# EAGLE design Isolator_12 (EAGLE 9.6.2)
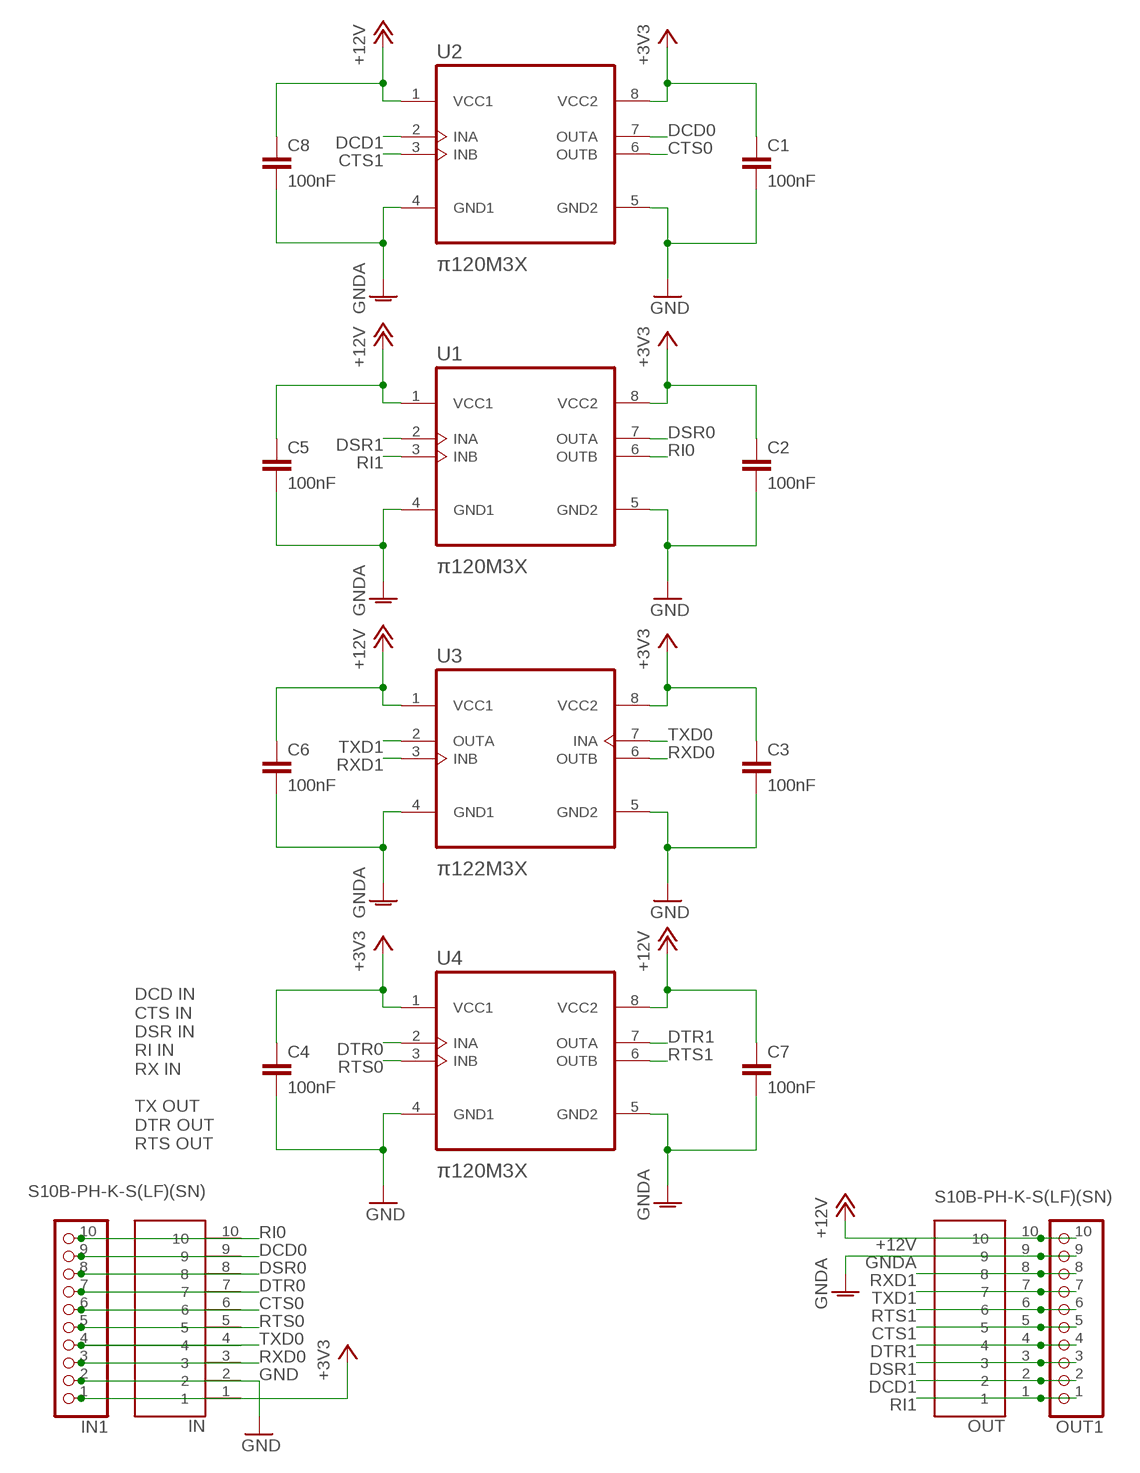
[diagram p0: schematic, sheet 1]

## Parts
C1  100nF  C-EUC0805  [C0805]
C2  100nF  C-EUC0805  [C0805]
C3  100nF  C-EUC0805  [C0805]
C4  100nF  C-EUC0805  [C0805]
C5  100nF  C-EUC0805  [C0805]
C6  100nF  C-EUC0805  [C0805]
C7  100nF  C-EUC0805  [C0805]
C8  100nF  C-EUC0805  [C0805]
IN  S10B-PH-K-S(LF)(SN)  [JST_S10B-PH-K-S(LF)(SN)]
IN1  PINHD-1X10  [1X10]
OUT  S10B-PH-K-S(LF)(SN)  [JST_S10B-PH-K-S(LF)(SN)]
OUT1  PINHD-1X10  [1X10]
U1  π120M3X  π120X3X  [SOIC-8]
U2  π120M3X  π120X3X  [SOIC-8]
U3  π122M3X  π122X3X  [SOIC-8]
U4  π120M3X  π120X3X  [SOIC-8]

## Nets
+3V3: C1.1 C2.1 C3.1 C4.1 IN1.1 IN.1 U1.8(VCC2) U2.8(VCC2) U3.8(VCC2) U4.1(VCC1)
+12V: C5.1 C6.1 C7.1 C8.1 OUT1.10 OUT.10 U1.1(VCC1) U2.1(VCC1) U3.1(VCC1) U4.8(VCC2)
CTS0: IN1.6 IN.6 U2.6(OUTB)
CTS1: OUT1.5 OUT.5 U2.3(INB)
DCD0: IN1.9 IN.9 U2.7(OUTA)
DCD1: OUT1.2 OUT.2 U2.2(INA)
DSR0: IN1.8 IN.8 U1.7(OUTA)
DSR1: OUT1.3 OUT.3 U1.2(INA)
DTR0: IN1.7 IN.7 U4.2(INA)
DTR1: OUT1.4 OUT.4 U4.7(OUTA)
GND: C1.2 C2.2 C3.2 C4.2 IN1.2 IN.2 U1.5(GND2) U2.5(GND2) U3.5(GND2) U4.4(GND1)
GNDA: C5.2 C6.2 C7.2 C8.2 OUT1.9 OUT.9 U1.4(GND1) U2.4(GND1) U3.4(GND1) U4.5(GND2)
RI0: IN1.10 IN.10 U1.6(OUTB)
RI1: OUT1.1 OUT.1 U1.3(INB)
RTS0: IN1.5 IN.5 U4.3(INB)
RTS1: OUT1.6 OUT.6 U4.6(OUTB)
RXD0: IN1.3 IN.3 U3.6(OUTB)
RXD1: OUT1.8 OUT.8 U3.3(INB)
TXD0: IN1.4 IN.4 U3.7(INA)
TXD1: OUT1.7 OUT.7 U3.2(OUTA)

## Notes on the sheet
- DCD IN
  CTS IN
  DSR IN
  RI IN
  RX IN
  
  TX OUT
  DTR OUT
  RTS OUT

## Library data of the parts
C1-C8 = rcl:C-EU: CAPACITOR, European symbol; SPICEPREFIX: C
IN OUT = S10B-PH-K-S_LF__SN_:S10B-PH-K-S(LF)(SN): PH Series 6 Position 2 mm Pitch Through Hole Side Entry Shrouded Header Check availability <https://pricing.snapeda.com/parts/S6B-PH-K-S%28LF%29%28SN%29/JST%20Sales/view-part?ref=eda>; AVAILABILITY: In Stock; DESCRIPTION: Connector Header Through Hole, Right Angle 6 position 0.079 (2.00mm); MF: JST Sales; MP: S6B-PH-K-S(LF)(SN); PACKAGE: None; PRICE: None; PURCHASE-URL: https://pricing.snapeda.com/search/part/S6B-PH-K-S(LF)(SN)/?ref=eda
IN1 OUT1 = pinhead:PINHD-1X10: PIN HEADER
U1 U2 U4 = π12XX3X:π120X3X: Check availability <https://pricing.snapeda.com/parts/ISO7421D/Texas%20Instruments/view-part?ref=eda>; AVAILABILITY: In Stock; DESCRIPTION: Dual-channel, 1/1, 1-Mbps digital isolator; MF: Texas Instruments; MP: ISO7421D; PACKAGE: SOIC-8 Texas Instruments; PRICE: None; PURCHASE-URL: https://pricing.snapeda.com/search/part/ISO7421D/?ref=eda
U3 = π12XX3X:π122X3X: Check availability <https://pricing.snapeda.com/parts/ISO7421D/Texas%20Instruments/view-part?ref=eda>; AVAILABILITY: In Stock; DESCRIPTION: Dual-channel, 1/1, 1-Mbps digital isolator; MF: Texas Instruments; MP: ISO7421D; PACKAGE: SOIC-8 Texas Instruments; PRICE: None; PURCHASE-URL: https://pricing.snapeda.com/search/part/ISO7421D/?ref=eda

## Board
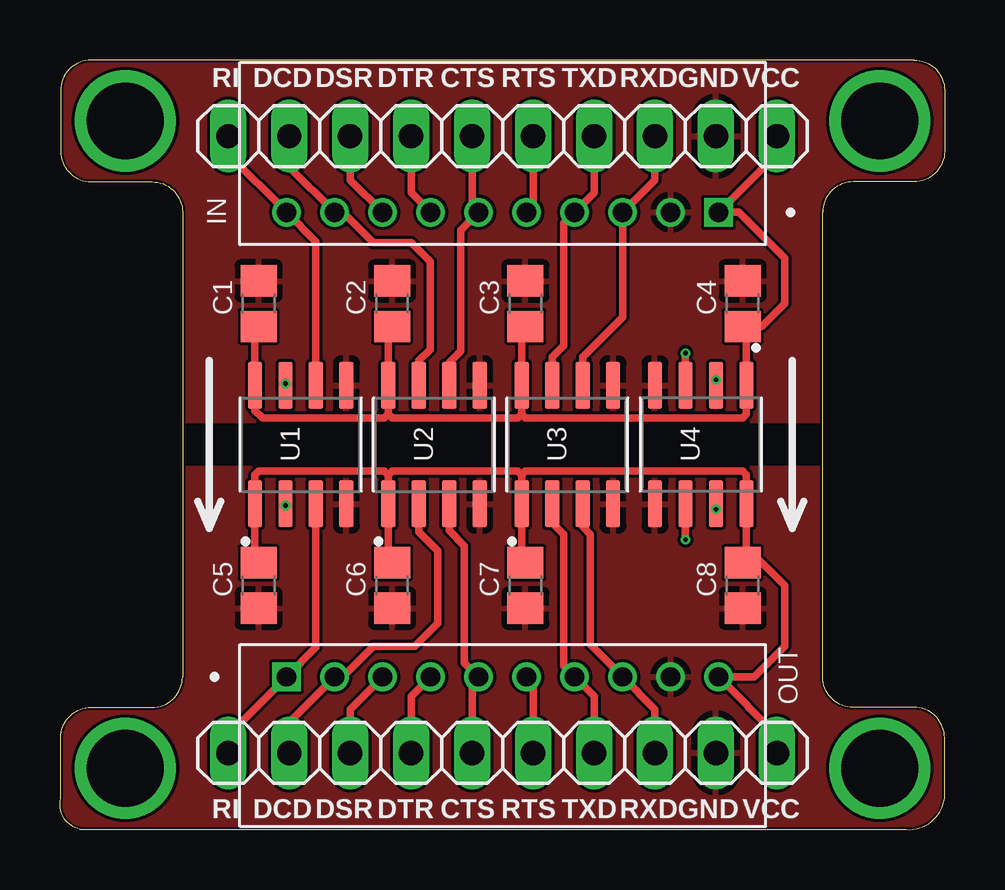
[diagram p1: board, top side]
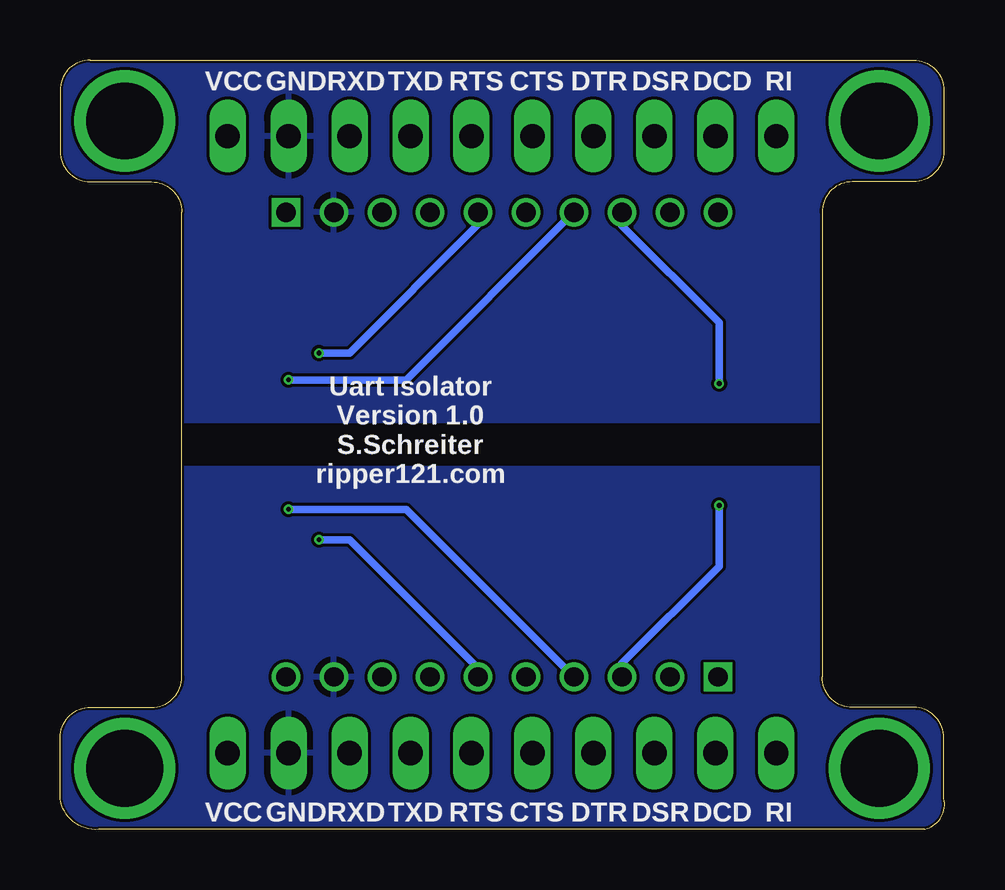
[diagram p2: board, bottom side, seen from below]

Size 36.86 x 32.09 mm. Coordinates in mm from the lower left corner, seen from the top.
Outline: 5.11,25.74 5.11,6.37 arc-90 3.84,5.1 1.3,5.1 arc90 0.03,3.83 0.03,1.29 arc90 0.82,0.02 35.11,0.02 arc90 36.86,1.29 36.86,3.83 arc90 35.59,5.1 33.05,5.1 arc-90 31.78,6.37 31.78,25.74 arc-90 33.05,27.01 35.59,27.01 arc90 36.86,28.28 36.86,30.82 arc90 35.59,32.09 1.3,32.09 arc90 0.03,30.82 0.03,28.28 arc90 1.3,27.01 3.84,27.01 arc-90 5.11,25.74
Copper layers (1*16): Top 0.035mm / dielectric 1.6mm / Bottom 0.035mm
Design rules "jlcpcb-2-layer *": minimum track width 12mil, minimum drill 0.2mm, track to track 5mil, track to pad 5mil, pad to pad 5mil, via to via 5mil, smd to smd 0mil, copper to edge 0.1mm, drill to drill 5mil, minimum pad ring 4mil, minimum via ring 4mil, stop-mask expansion 3mil, vias tented up to drill 100mil, thermal gap 10mil

### Footprints (pad centres in the part's own frame; a part is rotated, then mirrored left to right if it is on the bottom)
C0805 = smd 1.3 x 1.5: 1 -0.95,0; 2 0.95,0
JST_S10B-PH-K-S(LF)(SN) = drill 0.8 pad 1.2 square: 1 -9,0 | drill 0.8 pad 1.2: 2 -7,0; 3 -5,0; 4 -3,0; 5 -1,0; 6 1,0; 7 3,0; 8 5,0; 9 7,0; 10 9,0
1X10 = drill 1.016 long: 1 -11.43,0; 2 -8.89,0; 3 -6.35,0; 4 -3.81,0; 5 -1.27,0; 6 1.27,0; 7 3.81,0; 8 6.35,0; 9 8.89,0; 10 11.43,0
SOIC-8 = smd 1.97 x 0.6: 1 -2.47,1.905; 2 -2.47,0.635; 3 -2.47,-0.635; 4 -2.47,-1.905; 5 2.47,-1.905; 6 2.47,-0.635; 7 2.47,0.635; 8 2.47,1.905

### Placement (x,y rotation side)
C1  8.28,21.93 90 top
C2  13.84,21.93 90 top
C3  19.39,21.93 90 top
C4  28.44,21.93 90 top
C5  8.28,10.18 270 top
C6  13.84,10.18 270 top
C7  19.39,10.18 270 top
C8  28.44,10.18 270 top
IN  18.44,25.74 180 top
IN1  18.44,28.91 180 top
OUT  18.44,6.37 0 top
OUT1  18.44,3.19 0 top
U1  10.03,16.05 90 top
U2  15.58,16.05 90 top
U3  21.14,16.05 90 top
U4  26.7,16.05 270 top

### Tracks (layer width: path | path; a pad name or v marks a point on that pad's centre or on a via)
+3V3
  Top 0.305: IN1.1 29.87,28.17 IN.1 28.28,25.74 30.19,23.83 30.19,21.93 29.24,20.98 C4.1 28.6,20.82 U4.1 28.6,17.32 28.44,17.16 19.39,17.16 19.24,17.32 | C1.1 8.12,20.82 U1.8 8.12,17.48 8.44,17.16 13.52,17.16 13.68,17.32 | C2.1 13.68,20.82 U2.8 13.68,17.32 | C3.1 19.24,20.82 U3.8 19.24,17.32 | 13.68,17.32 13.84,17.16 19.08,17.16 19.24,17.32
+12V
  Top 0.305: OUT1.10 29.87,3.94 OUT.10 28.92,6.37 30.19,7.64 30.19,10.18 28.6,11.77 | 28.6,11.77 U4.8 28.6,14.78 28.44,14.94 19.39,14.94 19.24,14.78 | 28.6,11.77 28.6,11.29 C8.1 | C7.1 19.24,11.29 U3.1 19.24,14.78 | C6.1 13.68,11.29 U2.1 13.68,14.78 | C5.1 8.12,11.29 U1.1 8.12,14.78 8.28,14.94 13.52,14.94 13.68,14.78 | 13.68,14.78 13.84,14.94 19.08,14.94 19.24,14.78
CTS0
  Top 0.305: IN1.6 17.17,26.01 IN.6 16.7,24.99 16.7,19.95 16.22,19.47 U2.6
CTS1
  Top 0.305: OUT1.5 17.17,6.1 OUT.5 16.85,6.96 16.85,11.84 16.22,12.47 U2.3
DCD0
  Top 0.305: IN1.9 9.55,27.63 IN.9 11.77,25.74 13.04,24.47 14.63,24.47 15.43,23.67 15.43,20.02 14.95,19.54 U2.7
DCD1
  Top 0.305: OUT1.2 9.55,4.48 OUT.2 11.77,6.37 13.04,7.64 14.79,7.64 15.74,8.59 15.74,11.61 14.95,12.4 U2.2
DSR0  (via drill 0.2)
  Top 0.305: IN1.8 12.09,27.09 IN.8 | U1.7 v9.39,18.59
  Bottom 0.305: v9.39,18.59 9.39,21.13 13.44,25.18 IN.8
DSR1  (via drill 0.2)
  Top 0.305: OUT1.3 12.09,5.02 OUT.3 | U1.2 v9.39,13.51
  Bottom 0.305: v9.39,13.51 9.39,10.97 13.44,6.92 OUT.3
DTR0  (via drill 0.2)
  Top 0.305: IN1.7 14.63,26.55 IN.7 | v27.33,18.75 U4.2
  Bottom 0.305: v27.33,18.75 22.43,18.75 IN.7
DTR1  (via drill 0.2)
  Top 0.305: OUT1.4 14.63,5.56 OUT.4 | v27.33,13.35 U4.7
  Bottom 0.305: v27.33,13.35 22.43,13.35 OUT.4
GND
  pour Bottom: 0.03,32.09 36.86,32.09 36.86,17 0.03,17
  pour Top: 0.03,17 0.03,32.09 36.86,32.09 36.86,17
GNDA
  pour Top: 0.03,15.1 36.86,15.1 36.86,0.02 0.03,0.02
  pour Bottom: 0.03,0.02 36.86,0.02 36.86,15.1 0.03,15.1
N$1  (via drill 3.2)
  other vias: 2.72,29.55
N$2  (via drill 3.2)
  other vias: 34.16,29.55
N$3  (via drill 3.2)
  other vias: 34.16,2.56
N$4  (via drill 3.2)
  other vias: 2.72,2.56
RI0
  Top 0.305: IN1.10 7.01,28.17 IN.10 10.66,24.51 U1.6
RI1
  Top 0.305: OUT1.1 7.01,3.94 OUT.1 10.66,7.59 U1.3
RTS0  (via drill 0.2)
  Top 0.305: IN1.5 19.71,26.01 IN.5 | v26.06,19.86 U4.3
  Bottom 0.305: v26.06,19.86 24.79,19.86 19.44,25.21 IN.5
RTS1  (via drill 0.2)
  Top 0.305: OUT1.6 19.71,6.1 OUT.6 | v26.06,12.08 U4.6
  Bottom 0.305: v26.06,12.08 24.79,12.08 19.44,6.73 OUT.6
RXD0
  Top 0.305: IN1.3 24.79,27.09 IN.3 23.44,21.37 21.78,19.7 U3.6
RXD1
  Top 0.305: OUT1.8 24.79,5.02 OUT.8 22.09,7.72 22.09,12.31 21.78,12.63 U3.3
TXD0
  Top 0.305: IN1.4 22.25,26.55 IN.4 20.98,25.28 20.98,20.18 20.51,19.7 U3.7
TXD1
  Top 0.305: OUT1.7 22.25,5.56 OUT.7 20.98,6.83 20.98,12.31 20.51,12.79 U3.2

### Text on the board
tNames: RI | DCD | DSR | DTR | CTS | RTS | TXD | RXD | GND | VCC | RI | DCD | DSR | DTR | CTS | RTS | TXD | RXD | GND | VCC
bNames: RI | DCD | DSR | DTR | CTS | RTS | TXD | RXD | GND | VCC | Uart Isolator / Version 1.0 / S.Schreiter / ripper121.com | RI | DCD | DSR | DTR | CTS | RTS | TXD | RXD | GND | VCC